# EAGLE schematic MAX30003 (EAGLE 9.6.2)
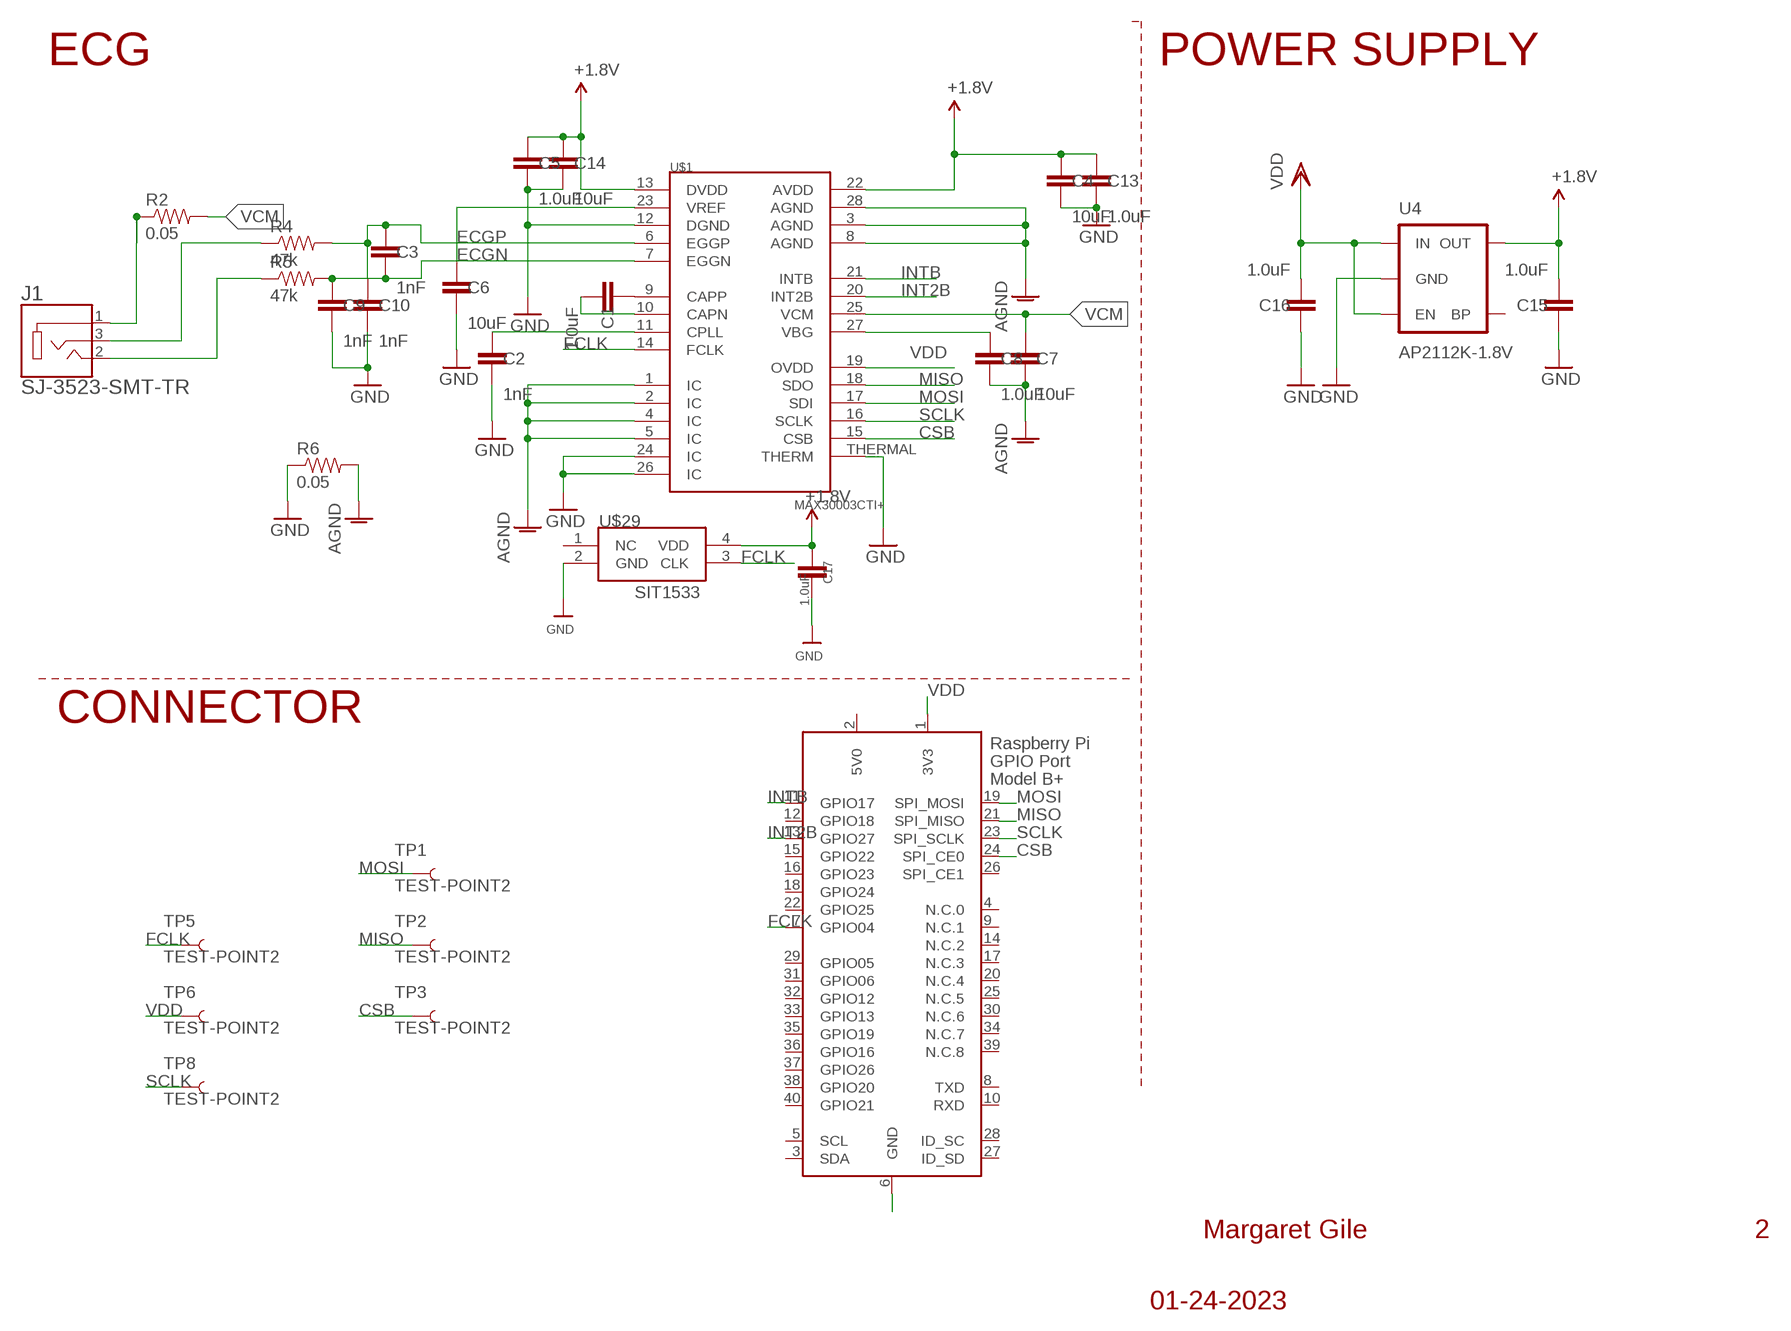
[diagram p0: schematic, sheet 1]

## Parts
C1  1.0uF  1.0UF-0603-16V-10%  [0603]
C2  1nF  1.0NF/1000PF-0603-50V-10%  [0603]
C3  1nF  1.0NF/1000PF-0603-50V-10%  [0603]
C4  10uF  10UF-0603-6.3V-20%  [0603]
C5  1.0uF  1.0UF-0603-16V-10%  [0603]
C6  10uF  10UF-0603-6.3V-20%  [0603]
C7  10uF  10UF-0603-6.3V-20%  [0603]
C8  1.0uF  1.0UF-0603-16V-10%  [0603]
C9  1nF  1.0NF/1000PF-0603-50V-10%  [0603]
C10  1nF  1.0NF/1000PF-0603-50V-10%  [0603]
C13  1.0uF  1.0UF-0603-16V-10%  [0603]
C14  10uF  10UF-0603-6.3V-20%  [0603]
C15  1.0uF  1.0UF-0603-16V-10%  [0603]
C16  1.0uF  1.0UF-0603-16V-10%  [0603]
C17  1.0uF  1.0UF-0603-16V-10%  [0603]
J1  SJ-3523-SMT-TR  [CUI_SJ-3523-SMT-TR]
R2  0.05  0.05OHM-0603-1/5W-1%  [0603]
R4  47k  47KOHM-0603-1/10W-1%  [0603]
R5  47k  47KOHM-0603-1/10W-1%  [0603]
R6  0.05  0.05OHM-0603-1/5W-1%  [0603]
TP1  TEST-POINT2  [PAD.02X.02]
TP2  TEST-POINT2  [PAD.02X.02]
TP3  TEST-POINT2  [PAD.02X.02]
TP5  TEST-POINT2  [PAD.02X.02]
TP6  TEST-POINT2  [PAD.02X.02]
TP8  TEST-POINT2  [PAD.02X.02]
U4  AP2112K-1.8V  V_REG_LDOSMD  [SOT23-5]
U$1  MAX30003CTI+  MAX30003  [QFN-28]
U$29  SIT1533  [SIT1533]
X1  RASPI_BOARD_B+_HDC  [RASPI_BOARD_B+HAT_DF_CF]

## Nets
+1.8V: C4.1 C5.1 C13.1 C14.1 C15.2 C17.1 U4.5(OUT) U$1.13(DVDD) U$1.22(AVDD) U$29.4(VDD)
AGND: C7.2 C8.2 R6.2 U$1.1(IC) U$1.2(IC) U$1.3(AGND) U$1.4(IC) U$1.5(IC) U$1.8(AGND) U$1.28(AGND)
CSB: TP3.P$1 U$1.15(CSB) X1.24(SPI_CE0)
ECGN: C3.2 C9.1 R5.2 U$1.7(EGGN)
ECGP: C3.1 C10.1 R4.2 U$1.6(EGGP)
FCLK: TP5.P$1 U$1.14(FCLK) U$29.3(CLK) X1.7(GPIO04)
GND: C2.2 C4.2 C5.2 C6.2 C9.2 C10.2 C13.2 C14.2 C15.1 C16.1 C17.2 R6.1 U4.2(GND) U$1.12(DGND) U$1.24(IC) U$1.26(IC) U$1.THERMAL(THERM) U$29.2(GND)
INT2B: U$1.20(INT2B) X1.13(GPIO27)
INTB: U$1.21(INTB) X1.11(GPIO17)
MISO: TP2.P$1 U$1.18(SDO) X1.21(SPI_MISO)
MOSI: TP1.P$1 U$1.17(SDI) X1.19(SPI_MOSI)
N$1: J1.3 R4.1
N$2: C6.1 U$1.23(VREF)
N$3: C1.1 U$1.9(CAPP)
N$4: J1.1 R2.1
N$5: X1.6(GND)
N$6: C1.2 U$1.10(CAPN)
N$7: C2.1 U$1.11(CPLL)
N$9: J1.2 R5.1
N$14: C8.1 U$1.27(VBG)
SCLK: TP8.P$1 U$1.16(SCLK) X1.23(SPI_SCLK)
VCM: C7.1 R2.2 U$1.25(VCM)
VDD: C16.2 TP6.P$1 U4.1(IN) U4.3(EN) U$1.19(OVDD) X1.1(3V3)
Unconnected: U4.4(BP) U$29.1(NC) X1.3(SDA) X1.4(N.C.0) X1.5(SCL) X1.8(TXD) X1.9(N.C.1) X1.10(RXD) X1.12(GPIO18) X1.14(N.C.2) X1.15(GPIO22) X1.16(GPIO23) X1.17(N.C.3) X1.18(GPIO24) X1.20(N.C.4) X1.22(GPIO25) X1.25(N.C.5) X1.26(SPI_CE1) X1.27(ID_SD) X1.28(ID_SC) X1.29(GPIO05) X1.30(N.C.6) X1.31(GPIO06) X1.32(GPIO12) X1.33(GPIO13) X1.34(N.C.7) X1.35(GPIO19) X1.36(GPIO16) X1.37(GPIO26) X1.38(GPIO20) X1.39(N.C.8) X1.40(GPIO21)

## Notes on the sheet
- ECG | POWER SUPPLY
- CONNECTOR
- Margaret Gile | 2
- 01-24-2023

## Power pins joined to a net without a drawn wire
5V0: X1.2(5V0)

## Library data of the parts
C1 C5 C8 C13 C15-C17 = SparkFun-Capacitors:1.0UF: 1µF ceramic capacitors A capacitor is a passive two-terminal electrical component used to store electrical energy temporarily in an electric field.; PROD_ID: CAP-00868
C2 C3 C9 C10 = SparkFun-Capacitors:1.0NF/1000PF: 1nF/1,000pF ceramic capacitors A capacitor is a passive two-terminal electrical component used to store electrical energy temporarily in an electric field.; PROD_ID: CAP-07886
C4 C6 C7 C14 = SparkFun-Capacitors:10UF: 10.0µF ceramic capacitors A capacitor is a passive two-terminal electrical component used to store electrical energy temporarily in an electric field.; PROD_ID: CAP-11015
J1 = SJ-3523-SMT-TR:SJ-3523-SMT-TR: Audio Jack Connector 3.5 mm Low Profile Surface Mount Stereo Jack, 3 Pin Right-Angle Check availability <https://pricing.snapeda.com/parts/SJ-3523-SMT-TR/CUI%20Devices/view-part?ref=eda>; AVAILABILITY: In Stock; CUI_PURCHASE_URL: https://www.cuidevices.com/product/interconnect/connectors/audio-connectors/jacks/sj-352x-smt-series?utm_source=snapeda.com&utm_medium=referral&utm_campaign=snapedaBOM; DESCRIPTION: 3.5 mm, Stereo, Right Angle, Surface Mount (SMT), 3 Conductors, 0~1 Internal Switches, Audio Jack Connector; MF: CUI Devices; MP: SJ-3523-SMT-TR; PACKAGE: None; PRICE: None; PURCHASE-URL: https://pricing.snapeda.com/search/part/SJ-3523-SMT-TR/?ref=eda
R2 R6 = SparkFun-Resistors:0.05OHM: 0.05Ω resistor A resistor is a passive two-terminal electrical component that implements electrical resistance as a circuit element. Resistors act to reduce current flow, and, at the same time, act to lower voltage levels within circuits. - Wikipedia; PROD_ID: RES-12535
R4 R5 = SparkFun-Resistors:47KOHM: 47kΩ resistor A resistor is a passive two-terminal electrical component that implements electrical resistance as a circuit element. Resistors act to reduce current flow, and, at the same time, act to lower voltage levels within circuits. - Wikipedia; PROD_ID: RES-07871
TP1-TP3 TP5 TP6 TP8 = SparkFun-Connectors@1:TEST-POINT: SparkFun Test Points Bare copper test points for troubleshooting or In-Circuit-Testing. These are used by our Production team for verifying production board runs using pogo-pins on test beds. SparkFun Products: SparkFun LSM9DS1 Breakout <https://www.sparkfun.com/products/13284> SparkFun PSOC <https://www.sparkfun.com/products/13714> SparkFun Load Cell Amplifier <https://www.sparkfun.com/products/13879>
U4 = SparkFun-PowerIC:V_REG_LDO: Voltage Regulator LDO Standard 150mA LDO voltage regulator in SOT-23 layout. Micrel part MIC5205. BP (by-pass) pin is used to lower output noise with 470pF cap.; PROD_ID: VREG-12457
U$1 = circuitects:MAX30003
U$29 = circuitects:SIT1533
X1 = raspberrypi_bastelstube_v13:RASPI_BOARD_B+: Raspberry Pi GPIO connector with markings for the outer dimensions of the Raspberry Pi board model B+ with different sets of drill holes or mounting pads